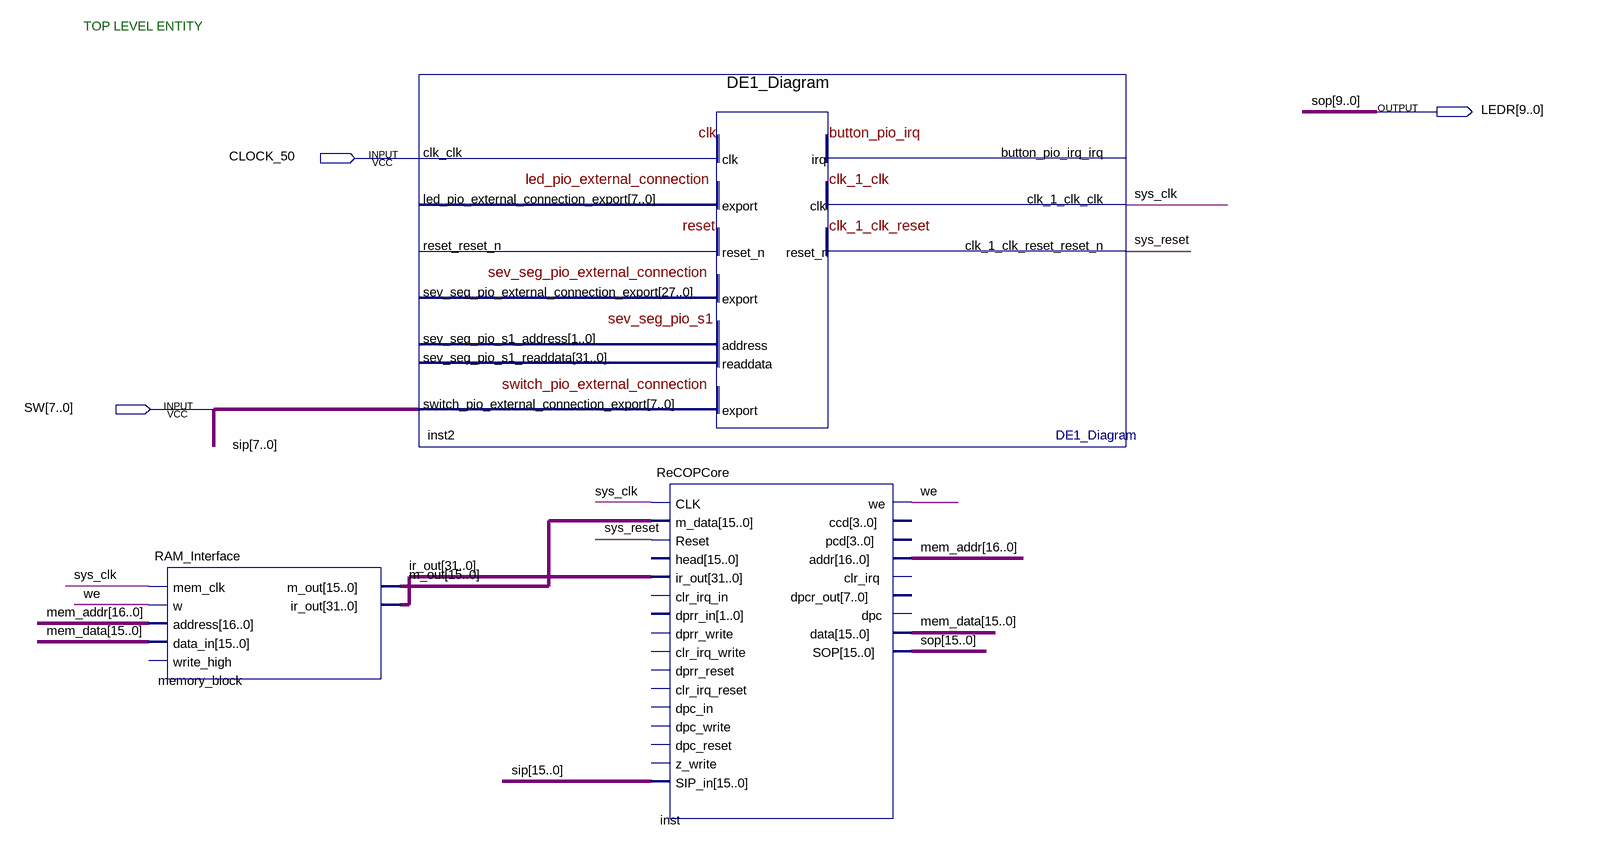
[diagram p0: schematic sheet]
// Quartus schematic ReCOPQuartus.bdf as structural Verilog: 3 symbols, 3 pins
module ReCOPQuartus (
  input  CLOCK_50,
  input  [7:0] SW,
  output [9:0] LEDR
);

  wire sys_clk, sys_reset, we;
  wire [15:0] m_out, mem_data;
  wire [15:8] sip;
  wire [15:10] sop;
  wire [16:0] mem_addr;
  wire [31:0] ir_out;

  RAM_Interface memory_block (
    .mem_clk(sys_clk), .w(we), .address(mem_addr), .data_in(mem_data), .m_out(m_out), .ir_out(ir_out));  // open: write_high
  DE1_Diagram inst2 (
    .clk_clk(CLOCK_50), .switch_pio_external_connection_export(SW), .clk_1_clk_clk(sys_clk),
    .clk_1_clk_reset_reset_n(sys_reset));  // open: reset_reset_n, sev_seg_pio_s1_address, button_pio_irq_irq, led_pio_external_connection_export, sev_seg_pio_external_connection_export, sev_seg_pio_s1_readdata
  ReCOPCore inst (
    .CLK(sys_clk), .m_data(m_out), .Reset(sys_reset), .ir_out(ir_out), .SIP_in({sip, SW}), .we(we),
    .addr(mem_addr), .data(mem_data), .SOP({sop, LEDR}));  // open: head, clr_irq_in, dprr_in, dprr_write, clr_irq_write, dprr_reset, clr_irq_reset, dpc_in, dpc_write, dpc_reset, z_write, ccd, pcd, clr_irq, dpcr_out, dpc

  // Other names for the same wires on the sheet: sip[7:0] = SW; sop[9:0] = LEDR

  // Notes on the sheet:
  //   TOP LEVEL ENTITY
endmodule
